# Altium schematic sheet MOTORS.SchDoc
size A4
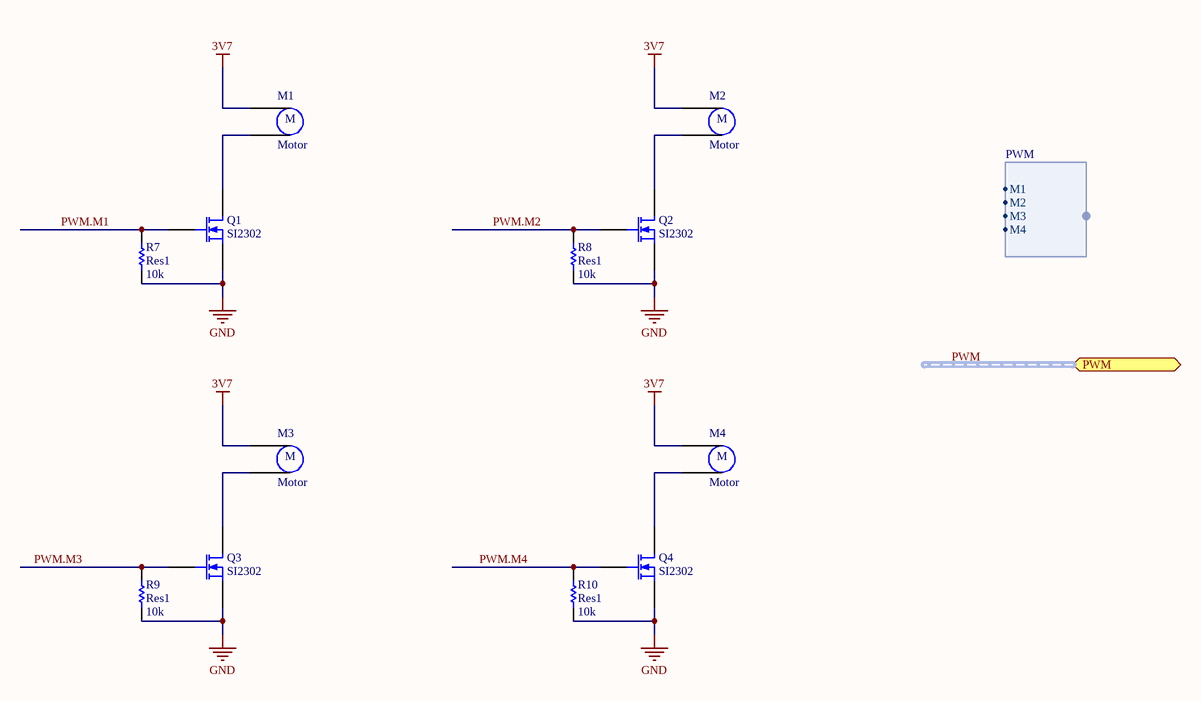
[diagram p0: MOTORS.SchDoc]

## Parts
M1  Motor  [HDR1X2_180_2.54]
M2  Motor  [HDR1X2_180_2.54]
M3  Motor  [HDR1X2_180_2.54]
M4  Motor  [HDR1X2_180_2.54]
Q1  SI2302  [SOT23]
Q2  SI2302  [SOT23]
Q3  SI2302  [SOT23]
Q4  SI2302  [SOT23]
R7  Res1  value 10k  [RES_0603]
R8  Res1  value 10k  [RES_0603]
R9  Res1  value 10k  [RES_0603]
R10  Res1  value 10k  [RES_0603]

## Ports
PWM (harness PWM)

## Harnesses
PWM: M1, M2, M3, M4

## Nets
3V7: M1.1 M2.1 M3.1 M4.1
GND: Q1.2(S) Q2.2(S) Q3.2(S) Q4.2(S) R7.1 R8.1 R9.1 R10.1
PWM.M1: Q1.1(G) R7.2
PWM.M2: Q2.1(G) R8.2
PWM.M3: Q3.1(G) R9.2
PWM.M4: Q4.1(G) R10.2
NetM1_2: M1.2 Q1.3(D)
NetM2_2: M2.2 Q2.3(D)
NetM3_2: M3.2 Q3.3(D)
NetM4_2: M4.2 Q4.3(D)

## Buses and harness runs
harness PWM = port PWM

## Notes on the sheet
- (in symbol Motor) M

## Library data of the parts
Q1-Q4 = SI2302: N-Channel MOSFET; Published: 8-Jun-2000; LatestRevisionDate: 17-Jul-2002; LatestRevisionNote: Re-released for DXP Platform.; PackageVersion: 1995/1996; PackageReference: E3; Publisher: Altium Limited; PackageDescription: TO, Flat Index; 3 In-Line, Axial Leads; Body Dia. 4.6mm; Lead Dia. 0.5 mm (max)
R7-R10 = Res1: Resistor; Published: 8-Jun-2000; LatestRevisionDate: 17-Jul-2002; LatestRevisionNote: Re-released for DXP Platform.; PackageReference: AXIAL-0.3; Publisher: Altium Limited; PackageDescription: Axial Device, Thru-Hole; 2 Leads; 0.3 in Pin Spacing